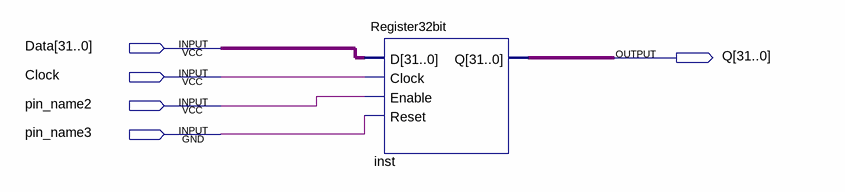
[diagram p0: schematic sheet]
// Quartus schematic TestBench.bdf as structural Verilog: 1 symbols, 5 pins
module TestBench (
  input  [31:0] Data,
  input  Clock,
  input  pin_name2,
  input  pin_name3,
  output [31:0] Q
);

  Register32bit inst (.D(Data), .Clock(Clock), .Enable(pin_name2), .Reset(pin_name3), .Q(Q));
endmodule
